# Altium schematic sheet Master_Schematik.SchDoc: Battery Management System
size 381 x 241 mm; DrawnBy: Tristan Horvath; SheetNumber: 1; SheetTotal: 1
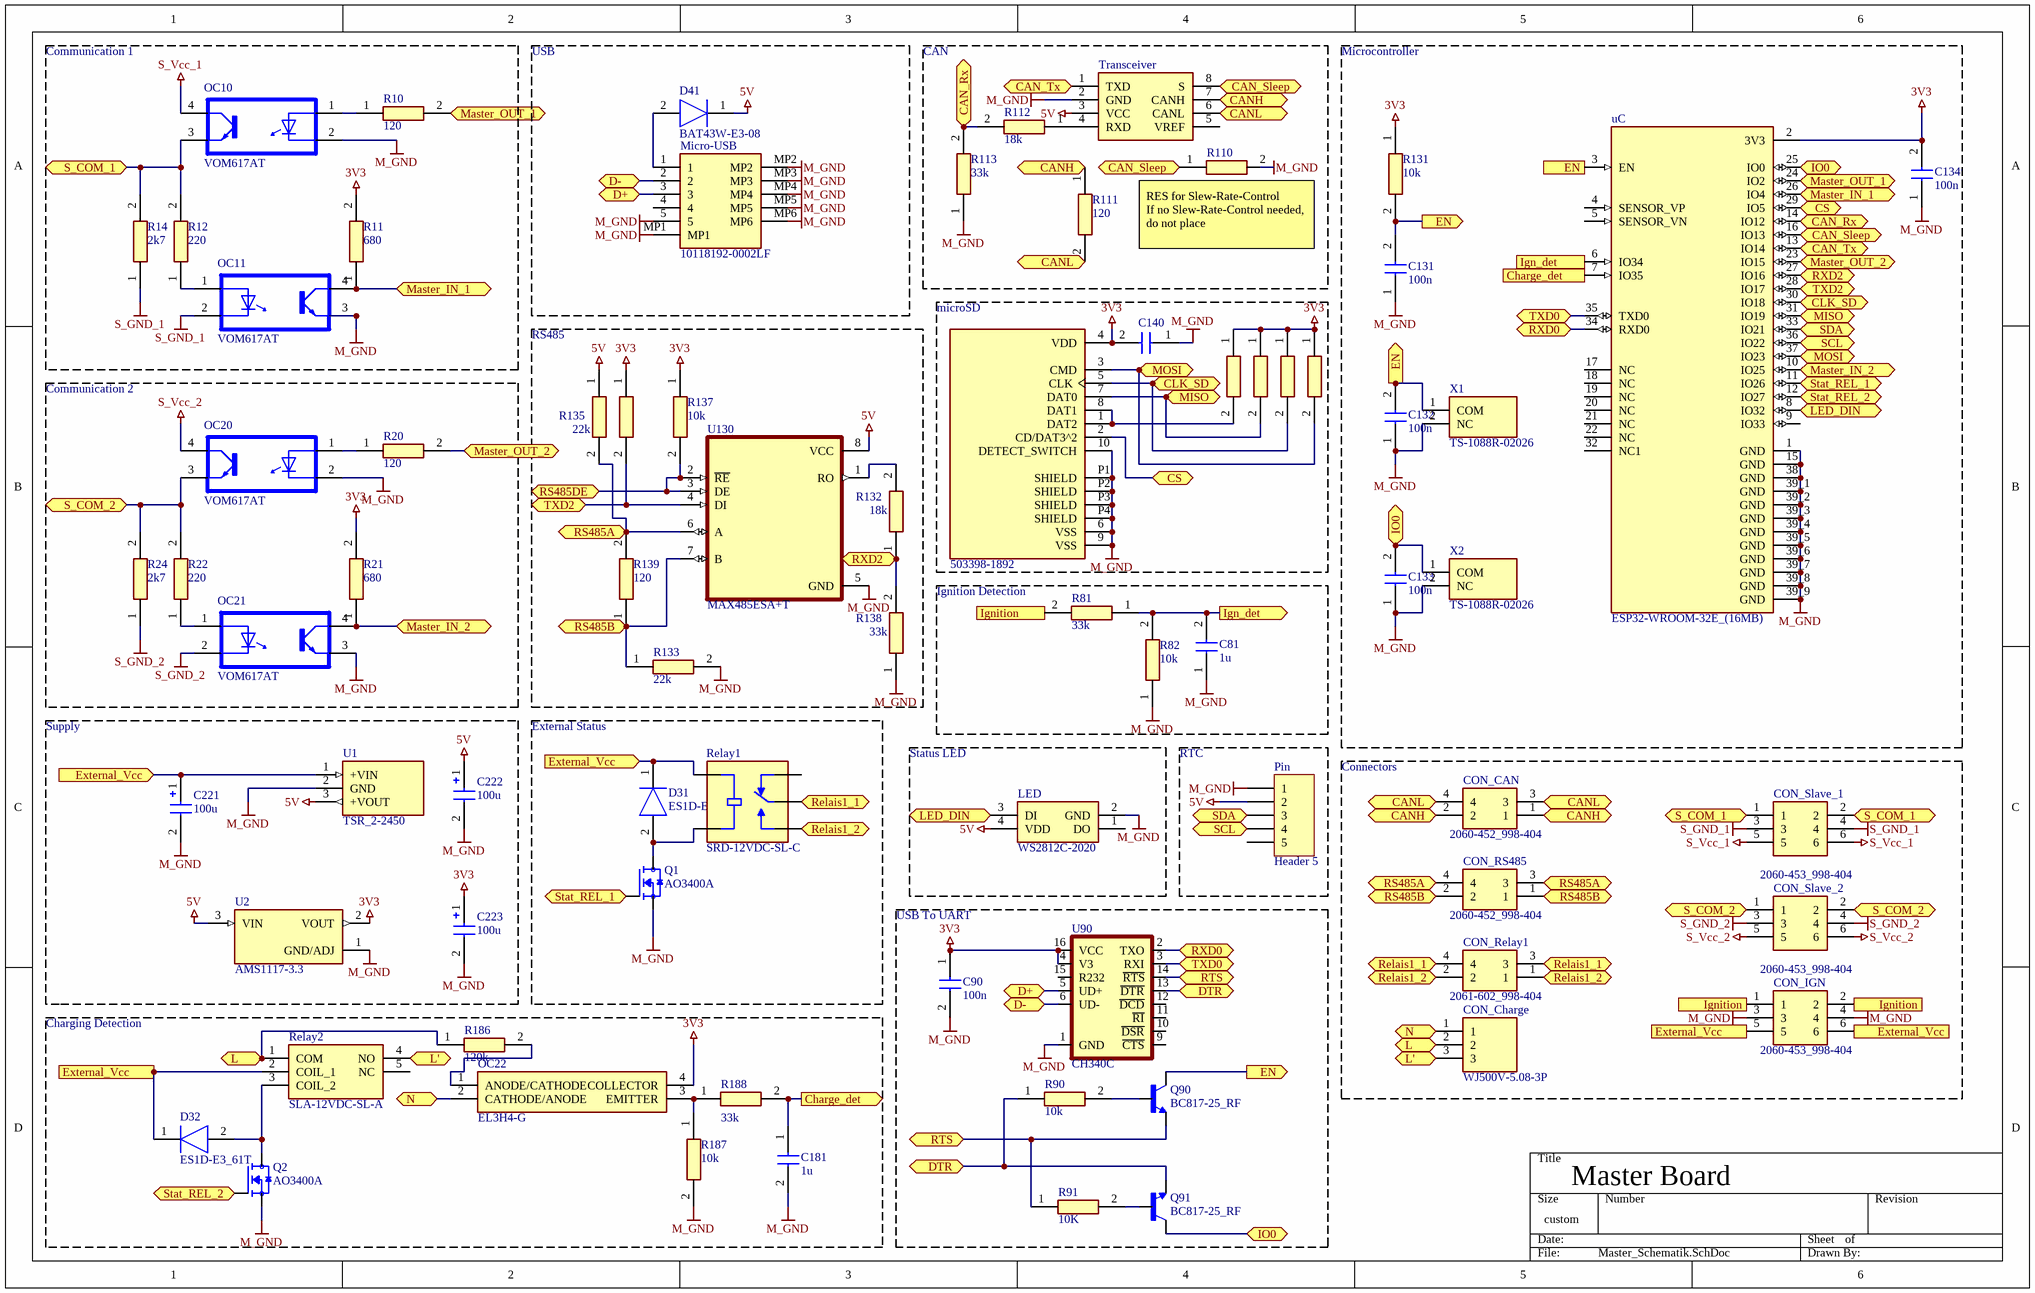
[diagram p0: Master_Schematik.SchDoc]

## Parts
C81  1u  [CAPC1608X90N]
C90  100n  [CAPC1608X90N]
C131  100n  [CAPC1608X90N]
C132  100n  [CAPC1608X90N]
C133  100n  [CAPC1608X90N]
C134  100n  [CAPC1608X90N]
C140  0.1u  [CAPC1608X90N]  (value not drawn)
C181  1u  [CAPC1608X90N]
C221  100u  [CAPAE530X550N]
C222  100u  [CAPAE530X550N]
C223  100u  [CAPAE530X550N]
CON_CAN  2060-452_998-404  [2060-452998-404]
CON_Charge  WJ500V-5.08-3P  [SHDR3W95P0X508_1X3_1524X1000X1420P]
CON_IGN  2060-453_998-404  [2060-453998-404]
CON_Relay1  2061-602_998-404  [2061-602998-404]
CON_RS485  2060-452_998-404  [2060-452998-404]
CON_Slave_1  2060-453_998-404  [2060-453998-404]
CON_Slave_2  2060-453_998-404  [2060-453998-404]
D31  ES1D-E3_61T  [DIOM5127X229N]
D32  ES1D-E3_61T  [DIOM5127X229N]
D41  BAT43W-E3-08  [SOD3716X135N]
LED  WS2812C-2020  [WS2812C2020]
Micro-USB  10118192-0002LF  [101181920002LF]
microSD  503398-1892  [MOLEX_503398-1892]
OC10  VOM617AT  [SOIC254P695X242-4N]
OC11  VOM617AT  [SOIC254P695X242-4N]
OC20  VOM617AT  [SOIC254P695X242-4N]
OC21  VOM617AT  [SOIC254P695X242-4N]
OC22  EL3H4-G  [EL3H4G]
Pin  Header 5  [HDR1X5]
Q1  AO3400A  [SOT95P237X112-3N]
Q2  AO3400A  [SOT95P237X112-3N]
Q90  BC817-25_RF  [SOT95P237X112-3N]
Q91  BC817-25_RF  [SOT95P237X112-3N]
R10  120  [RESC1608X55N]
R11  680  [RESC1608X55N]
R12  220  [RESC1608X55N]
R14  2k7  [RESC1608X55N]
R20  120  [RESC1608X55N]
R21  680  [RESC1608X55N]
R22  220  [RESC1608X55N]
R24  2k7  [RESC1608X55N]
R81  33k  [RESC1608X55N]
R82  10k  [RESC1608X55N]
R90  10k  [RESC1608X55N]
R91  10K  [RESC1608X55N]
R110  N.P.  [RESC1608X55N]  (value not drawn)
R111  120  [RESC1608X55N]
R112  18k  [RESC1608X55N]
R113  33k  [RESC1608X55N]
R131  10k  [RESC1608X55N]
R132  18k  [RESC1608X55N]
R133  22k  [RESC1608X55N]
R135  22k  [RESC1608X55N]
R136  10k  [RESC1608X55N]  (value not drawn)
R137  10k  [RESC1608X55N]
R138  33k  [RESC1608X55N]
R139  120  [RESC1608X55N]
R140  10k  [RESC1608X55N]  (value not drawn)
R141  10k  [RESC1608X55N]  (value not drawn)
R142  10k  [RESC1608X55N]  (value not drawn)
R143  10k  [RESC1608X55N]  (value not drawn)
R186  120k  [2512RES]
R187  10k  [RESC1608X55N]
R188  33k  [RESC1608X55N]
Relay1  SRD-12VDC-SL-C  [RELAY_SRD-12VDC-SL-C]
Relay2  SLA-12VDC-SL-A  [SLA12VDCSLA]
Transceiver  TJA1050T_CM_118  [SOIC127P600X175-8N]  (value not drawn)
U1  TSR_2-2450  [TSR-2]
U2  AMS1117-3.3  [SOT229P700X180-4N]
U90  CH340C  [SO016]
U130  MAX485ESA+T  [SOIC127P600X175-8N]
uC  ESP32-WROOM-32E_(16MB)  [XCVR_ESP32-WROOM-32E_(16MB) - duplicate]
X1  TS-1088R-02026  [TS1088R02026]
X2  TS-1088R-02026  [TS1088R02026]

## Blocks framed on the sheet
Communication 1: OC10 OC11 R10-R12 R14
USB: D41 Micro-USB
CAN: R110-R113 Transceiver
Microcontroller: C131-C134 R131 uC X1 X2
RS485: R132 R133 R135-R139 U130
Communication 2: OC20 OC21 R20-R22 R24
Ignition Detection: C81 R81 R82
Supply: C221-C223 U1 U2
External Status: D31 Q1 Relay1
Status LED: LED
RTC: Pin
Connectors: CON_CAN CON_Charge CON_IGN CON_Relay1 CON_RS485 CON_Slave_1 CON_Slave_2
USB To UART: C90 Q90 Q91 R90 R91 U90
Charging Detection: C181 D32 OC22 Q2 R186-R188 Relay2

## Ports
CAN_Rx (bidir), CAN_Sleep (bidir), CAN_Tx (bidir), CANH (bidir), CANL (bidir), Charge_det (in), Charge_det (out), CLK_SD (bidir), CS (bidir), D+ (bidir), D- (bidir), DTR (bidir), EN (in), EN (out), External_Vcc (in), External_Vcc (out), Ign_det (in), Ign_det (out), Ignition (in), Ignition (out), IO0 (bidir), L (bidir), L' (bidir), LED_DIN (bidir), Master_IN_1 (bidir), Master_IN_2 (bidir), Master_OUT_1 (bidir), Master_OUT_2 (bidir), MISO (bidir), MOSI (bidir), N (bidir), Relais1_1 (bidir), Relais1_2 (bidir), RS485A (bidir), RS485B (bidir), RS485DE (bidir), RTS (bidir), RXD0 (bidir), RXD2 (bidir), S_COM_1 (bidir), S_COM_2 (bidir), SCL (bidir), SDA (bidir), Stat_REL_1 (bidir), Stat_REL_2 (bidir), TXD0 (bidir), TXD2 (bidir)

## Nets
3V3: C90.1 C134.2 C140.2 C223.1(+) microSD.4(VDD) OC22.4(COLLECTOR) R11.2 R21.2 R131.1 R136.1 R137.1 R140.1 R141.1 R142.1 R143.1 U2.2(VOUT) U90.4(V3) U90.16(VCC) uC.2(3V3)
5V: C222.1(+) D41.1(K) LED.4(VDD) Pin.2 R135.1 Transceiver.3(VCC) U1.3(+VOUT) U2.3(VIN) U130.8(VCC)
M_GND: C81.1 C90.2 C131.1 C132.1 C133.1 C134.1 C140.1 C181.2 C221.2(-) C222.2(-) C223.2(-) CON_IGN.3 CON_IGN.4 LED.2(GND) Micro-USB.5 Micro-USB.MP1 Micro-USB.MP2 Micro-USB.MP3 Micro-USB.MP4 Micro-USB.MP5 Micro-USB.MP6 microSD.6(VSS) microSD.9(VSS) microSD.10(DETECT_SWITCH) microSD.P1(SHIELD) microSD.P2(SHIELD) microSD.P3(SHIELD) microSD.P4(SHIELD) OC10.2(C) OC11.3(E) OC20.2(C) OC21.3(E) Pin.1 Q1.2(S) Q2.2(S) R82.1 R110.2 R113.1 R133.2 R138.1 R187.2 Transceiver.2(GND) U1.2(GND) U2.1(GND/ADJ) U90.1(GND) U130.5(GND) uC.1(GND) uC.15(GND) uC.38(GND) uC.39_1(GND) uC.39_2(GND) uC.39_3(GND) uC.39_4(GND) uC.39_5(GND) uC.39_6(GND) uC.39_7(GND) uC.39_8(GND) uC.39_9(GND) X1.2(NC) X2.2(NC)
S_GND_1: CON_Slave_1.3 CON_Slave_1.4 OC11.2(C) R14.1
S_GND_2: CON_Slave_2.3 CON_Slave_2.4 OC21.2(C) R24.1
S_Vcc_1: CON_Slave_1.5 CON_Slave_1.6 OC10.4(CO)
S_Vcc_2: CON_Slave_2.5 CON_Slave_2.6 OC20.4(CO)
CAN_Rx: R112.2 R113.2 uC.14(IO12) ; port CAN_Rx
CAN_Sleep: R110.1 Transceiver.8(S) uC.16(IO13) ; port CAN_Sleep
CAN_Tx: Transceiver.1(TXD) uC.13(IO14) ; port CAN_Tx
CANH: CON_CAN.1 CON_CAN.2 R111.1 Transceiver.7(CANH) ; port CANH
CANL: CON_CAN.3 CON_CAN.4 R111.2 Transceiver.6(CANL) ; port CANL
Charge_det: C181.1 R188.2 uC.7(IO35) ; port Charge_det
CLK_SD: microSD.5(CLK) R142.2 uC.30(IO18) ; port CLK_SD
CS: microSD.2(CD/DAT3^2) uC.29(IO5) ; port CS
D+: Micro-USB.3 U90.5(UD+) ; port D+
D-: Micro-USB.2 U90.6(UD-) ; port D-
DTR: Q91.2(E) R90.1 U90.13(~{DTR}) ; port DTR
EN: C131.2 C132.2 Q90.3(C) R131.2 uC.3(EN) X1.1(COM) ; port EN
External_Vcc: C221.1(+) CON_IGN.5 CON_IGN.6 D31.1(K) D32.1(K) Relay1.COIL1 Relay2.2(COIL_1) U1.1(+VIN) ; port External_Vcc
Ign_det: C81.2 R81.1 R82.2 uC.6(IO34) ; port Ign_det
Ignition: CON_IGN.1 CON_IGN.2 R81.2 ; port Ignition
IO0: C133.2 Q91.3(C) uC.25(IO0) X2.1(COM) ; port IO0
L: CON_Charge.2 R186.1 Relay2.1(COM) ; port L
L': CON_Charge.3 Relay2.4(NO) ; port L'
LED_DIN: LED.3(DI) uC.8(IO32) ; port LED_DIN
Master_IN_1: OC11.4(CO) R11.1 uC.26(IO4) ; port Master_IN_1
Master_IN_2: OC21.4(CO) R21.1 uC.10(IO25) ; port Master_IN_2
Master_OUT_1: R10.2 uC.24(IO2) ; port Master_OUT_1
Master_OUT_2: R20.2 uC.23(IO15) ; port Master_OUT_2
MISO: microSD.7(DAT0) R141.2 uC.31(IO19) ; port MISO
MOSI: microSD.3(CMD) R143.2 uC.37(IO23) ; port MOSI
N: CON_Charge.1 OC22.2(CATHODE/ANODE) ; port N
Relais1_1: CON_Relay1.3 CON_Relay1.4 Relay1.COM ; port Relais1_1
Relais1_2: CON_Relay1.1 CON_Relay1.2 Relay1.NO ; port Relais1_2
RS485A: CON_RS485.3 CON_RS485.4 R135.2 R139.2 U130.6(A) ; port RS485A
RS485B: CON_RS485.1 CON_RS485.2 R133.1 R139.1 U130.7(B) ; port RS485B
RS485DE: R137.2 U130.2(~{RE}) U130.3(DE) ; port RS485DE
RTS: Q90.2(E) R91.1 U90.14(~{RTS}) ; port RTS
RXD0: U90.2(TXO) uC.34(RXD0) ; port RXD0
RXD2: R132.1 R138.2 uC.27(IO16) ; port RXD2
S_COM_1: CON_Slave_1.1 CON_Slave_1.2 OC10.3(E) R12.2 R14.2 ; port S_COM_1
S_COM_2: CON_Slave_2.1 CON_Slave_2.2 OC20.3(E) R22.2 R24.2 ; port S_COM_2
SCL: Pin.4 uC.36(IO22) ; port SCL
SDA: Pin.3 uC.33(IO21) ; port SDA
Stat_REL_1: Q1.1(G) uC.11(IO26) ; port Stat_REL_1
Stat_REL_2: Q2.1(G) uC.12(IO27) ; port Stat_REL_2
TXD0: U90.3(RXI) uC.35(TXD0) ; port TXD0
TXD2: R136.2 U130.4(DI) uC.28(IO17) ; port TXD2
NetD31_2: D31.2(A) Q1.3(D) Relay1.COIL2
NetD32_2: D32.2(A) Q2.3(D) Relay2.3(COIL_2)
NetD41_2: D41.2(A) Micro-USB.1
NetmicroSD_1: microSD.1(DAT2) microSD.8(DAT1) R140.2
NetOC10_1: OC10.1(A) R10.1
NetOC11_1: OC11.1(A) R12.1
NetOC20_1: OC20.1(A) R20.1
NetOC21_1: OC21.1(A) R22.1
NetOC22_1: OC22.1(ANODE/CATHODE) R186.2
NetOC22_3: OC22.3(EMITTER) R187.1 R188.1
NetQ90_1: Q90.1(B) R90.2
NetQ91_1: Q91.1(B) R91.2
NetR112_1: R112.1 Transceiver.4(RXD)
NetR132_2: R132.2 U130.1(RO)

Not connected (* = marked no-connect by the designer): LED 1(DO); Micro-USB 4; Pin 5; Relay1 NC; Relay2 5(NC); Transceiver 5(VREF); U90 9(~{CTS}) 10(~{DSR}) 11(~{RI}) 12(~{DCD}) 15(R232); uC 4(SENSOR_VP) 5(SENSOR_VN) 9(IO33) 17(NC) 18(NC) 19(NC) 20(NC) 21(NC) 22(NC) 32(NC1)

## Notes on the sheet
- (near R110) RES for Slew-Rate-Control
  If no Slew-Rate-Control needed, do not place
- Master Board

## Library data of the parts
C81 C90 C131-C134 C140 = CAP
C181 = CAP: Tp mit fg 5Hz
C221-C223 = ELKO
CON_CAN CON_RS485 = 2060-452_998-404: Connector; Manufacturer_Name: Wago; Manufacturer_Part_Number: 2061-602/998-404; Arrow Part Number: 2060-452/998-404; Arrow Price/Stock: https://www.arrow.com/en/products/2060-452998-404/wago-kontakttechnik-gmbh?region=nac
CON_Charge = WJ500V-5.08-3P: P=5.08mm Screw terminal RoHS; Manufacturer_Name: Ningbo Kangnex; Geometry.Height: 14.2mm; Manufacturer_Part_Number: WJ500V-5.08-3P; Mouser Part Number: *; Mouser Price/Stock: *; Arrow Part Number: *; Arrow Price/Stock: *; Datasheet Link: https://datasheet.lcsc.com/szlcsc/Ningbo-Kangnex-Elec-WJ500V-5-08-3P-14-00A_C72334.pdf
CON_IGN CON_Slave_1 CON_Slave_2 = 2060-453_998-404: Connector; Manufacturer_Name: Wago; Manufacturer_Part_Number: 2060-452/998-404; Arrow Part Number: 2060-452/998-404; Arrow Price/Stock: https://www.arrow.com/en/products/2060-452998-404/wago-kontakttechnik-gmbh?region=nac
CON_Relay1 = 2061-602_998-404: Connector; Manufacturer_Name: Wago; Manufacturer_Part_Number: 2060-452/998-404; Arrow Part Number: 2060-452/998-404; Arrow Price/Stock: https://www.arrow.com/en/products/2060-452998-404/wago-kontakttechnik-gmbh?region=nac
D31 D32 = ES1D-E3_61T: Diode; Manufacturer_Name: Vishay; Manufacturer_Part_Number: ES1D-E3/61T; Datasheet Link: https://componentsearchengine.com/Datasheets/2/ES1D-E3_61T.pdf; Height: 2.29mm; Mouser Part Number: 625-ES1D-E3; Mouser Price/Stock: https://www.mouser.co.uk/ProductDetail/Vishay-General-Semiconductor/ES1D-E3-61T?qs=rfh7uIuiIO0XwaKoN5aNdQ%3D%3D; Arrow Part Number: ES1D-E3/61T; Arrow Price/Stock: https://www.arrow.com/en/products/es1d-e361t/vishay
D41 = BAT43W-E3-08: Diode; Manufacturer_Name: Vishay; Datasheet Link: https://www.arrow.com/en/products/bat43w-e3-08/vishay; Height: 1.35mm; Manufacturer_Part_Number: BAT43W-E3-08; Mouser Part Number: 78-BAT43W-E3-08; Mouser Price/Stock: https://www.mouser.co.uk/ProductDetail/Vishay-Semiconductors/BAT43W-E3-08?qs=KP8Io%2FXyE5RCw3lmmA3XwQ%3D%3D; Arrow Part Number: BAT43W-E3-08; Arrow Price/Stock: https://www.arrow.com/en/products/bat43w-e3-08/vishay?region=nac
LED = WS2812C-2020: LED; Manufacturer_Name: Worldsemi; Datasheet Link: http://www.world-semi.com/DownLoadFile/139; Height: 0.84mm; Manufacturer_Part_Number: WS2812C-2020
Micro-USB = 10118192-0002LF: Connector; Manufacturer_Name: Amphenol; Datasheet Link: https://componentsearchengine.com/Datasheets/1/10118192-0002LF.pdf; Height: 3.05mm; Manufacturer_Part_Number: 10118192-0002LF; Mouser Part Number: 649-10118192-0002LF; Mouser Price/Stock: https://www.mouser.co.uk/ProductDetail/Amphenol-FCI/10118192-0002LF?qs=KVgMXE4aH4nIkuWlMxQzog%3D%3D; Arrow Part Number: 10118192-0002LF; Arrow Price/Stock: https://www.arrow.com/en/products/10118192-0002lf/amphenol-fci?region=nac
microSD = 503398-1892: 9 (8 + 1) Position Card Connector Secure Digital - microSDâ„¢ Surface Mount, Right Angle Gold; MP: 5033981892; MF: Molex; Check_prices: https://www.snapeda.com/parts/5033981892/Molex/view-part/?ref=eda; Value: *; Availability: In Stock; Price: None; Package: None; SnapEDA_Link: https://www.snapeda.com/parts/5033981892/Molex/view-part/?ref=snap; Purchase-URL: https://pricing.snapeda.com/search/part/5033981892/?ref=eda
OC10 OC11 OC20 OC21 = VOM617AT: Optoisolator Transistor Output 3750Vrms 1 Channel 4-SOP _2.54mm_; MF: Vishay Semiconductor; Package: SOP-4 Vishay Semiconductor; Value: *; Availability: Unavailable; SnapEDA_Link: https://www.snapeda.com/parts/VOM617AT/Vishay%20Semiconductor%20Opto%20Division/view-part/289684/?ref=snap; Price: None; MP: VOM617AT
OC22 = EL3H4-G: OPTOISOLATOR 3.75KV TRANS 4-SSOP; Manufacturer_Name: Everlight; Geometry.Height: 2mm; Manufacturer_Part_Number: EL3H4-G; Mouser Part Number: 638-EL3H4G; Mouser Price/Stock: https://www.mouser.co.uk/ProductDetail/Everlight/EL3H4-G?qs=8PzhAHr7IdNyIMBpWTp8ig%3D%3D; Arrow Part Number: *; Arrow Price/Stock: *; Datasheet Link: https://componentsearchengine.com/Datasheets/1/EL3H4-G.pdf
Pin = Header 5: Header, 5-Pin; LatestRevisionDate: 17-Jul-2002; LatestRevisionNote: Re-released for DXP Platform.; Publisher: Altium Limited
Q1 Q2 = AO3400A: Trans MOSFET N-CH 30V 5.7A 3-Pin SOT-23; Package: None; Price: None; Availability: Unavailable; MP: AO3400A; Value: *
Q90 Q91 = BC817-25_RF: SOT-23, 50V, 0.5A, NPN Bipolar Transistor; MF: Taiwan Semiconductor; MP: BC817-25 RF; Package: SOT-23 Taiwan Semiconductor; Value: *; Availability: In Stock; Check_prices: https://www.snapeda.com/parts/BC817-25%20RF/Taiwan+Semiconductor/view-part/?ref=eda; SnapEDA_Link: https://www.snapeda.com/parts/BC817-25%20RF/Taiwan+Semiconductor/view-part/?ref=snap; Price: None; Purchase-URL: https://pricing.snapeda.com/search/part/BC817-25 RF/?ref=eda
R10-R12 R14 R20-R22 R24 R81 R82 R90 R91 R110-R113 R131-R133 R135-R143 R186 R187 = RES
R188 = RES: TP mit fg 5Hz
Relay1 = SRD-12VDC-SL-C: General Purpose Non Latching 12VDC SPDT Through Hole Relays RoHS; Price: None; Package: None; Availability: Unavailable; MP: SRD-12VDC-SL-C; Value: *
Relay2 = SLA-12VDC-SL-A: Relay or Contactor; Manufacturer_Name: Songle Relay; Datasheet Link: https://datasheet.lcsc.com/szlcsc/1811200235_Ningbo-Songle-Relay-SLA-12VDC-SL-A_C55194.pdf; Height: 20.4mm; Manufacturer_Part_Number: SLA-12VDC-SL-A
Transceiver = TJA1050T_CM_118: NXP - TJA1050T/CM,118 - CAN TRANSCEIVER, 1TX/RX, SOIC-8; Geometry.Height: 1.75mm; Manufacturer_Name: NXP; Manufacturer_Part_Number: TJA1050T/CM,118; Mouser Part Number: 771-TJA1050T/CM118; Mouser Price/Stock: https://www.mouser.co.uk/ProductDetail/NXP-Semiconductors/TJA1050T-CM118?qs=5XOdhvmYM0NFFspw0VP5sA%3D%3D; Arrow Part Number: TJA1050T/CM,118; Arrow Price/Stock: https://www.arrow.com/en/products/tja1050tcm118/nxp-semiconductors?region=nac; Datasheet Link: http://www.nxp.com/docs/en/data-sheet/TJA1050.pdf
U1 = TSR_2-2450: Power Supply; Manufacturer_Name: Traco Power; Manufacturer_Part_Number: TSR 2-2450; Datasheet Link: https://tracopower.com/tsr2-datasheet/; Mouser Part Number: 495-TSR2-2450; Mouser Price/Stock: https://www.mouser.co.uk/ProductDetail/TRACO-Power/TSR-2-2450?qs=NtE2QagKf6RzknAolzm%2FTQ%3D%3D; Arrow Part Number: TSR 2-2450; Arrow Price/Stock: https://www.arrow.com/en/products/tsr2-2450/traco-electronic-ag?region=europe
U2 = AMS1117-3.3: Sot223/Pkg 1-Amp 3.3-Volt Low Drop Out Voltage Regulatator; MF: Advanced Monolithic Systems; Package: SOT-223 Seeed Technology; Value: *; Check_prices: https://www.snapeda.com/parts/AMS1117-3.3/Advanced+Monolithic+Systems/view-part/?ref=eda; Price: None; Availability: Not in stock; MP: AMS1117-3.3; SnapEDA_Link: https://www.snapeda.com/parts/AMS1117-3.3/Advanced+Monolithic+Systems/view-part/?ref=snap
U90 = CH340C: Replacement for Brother P-Touch; MF: Olimex; SnapEDA_Link: https://www.snapeda.com/parts/CH340C/Olimex/view-part/?ref=snap; Availability: Not in stock; MP: CH340C; Price: None; Value: *; Check_prices: https://www.snapeda.com/parts/CH340C/Olimex/view-part/?ref=eda; Package: None
U130 = MAX485ESA+T: 1/1 Transceiver Half RS422, RS485 8-SOIC; MF: Maxim Integrated; MP: MAX485ESA; SnapEDA_Link: https://www.snapeda.com/parts/MAX485ESA/Maxim+Integrated/view-part/?ref=snap; Purchase-URL: https://pricing.snapeda.com/search/part/MAX485ESA/?ref=eda; Value: *; Package: SOIC-8 Maxim; Price: None; Availability: In Stock; Check_prices: https://www.snapeda.com/parts/MAX485ESA/Maxim+Integrated/view-part/?ref=eda
uC = ESP32-WROOM-32E_(16MB): Bluetooth, WiFi 802.11b/g/n, Bluetooth v4.2 +EDR, Class 1, 2 and 3 Transceiver Module 2.4GHz ~ 2.5GHz Integrated, Trace Surface Mount; MP: ESP32-WROOM-32E (16MB); MF: Espressif Systems; Price: None; Availability: Not in stock; Package: None; Value: *; SnapEDA_Link: https://www.snapeda.com/parts/ESP32-WROOM-32E%20(16MB)/Espressif+Systems/view-part/?ref=snap; Check_prices: https://www.snapeda.com/parts/ESP32-WROOM-32E%20(16MB)/Espressif+Systems/view-part/?ref=eda
X1 X2 = TS-1088R-02026: SMD,3x4x2.0mm Tactile Switches; Manufacturer_Name: XUNPU; Geometry.Height: 2.2mm; Manufacturer_Part_Number: TS-1088R-02026; Mouser Part Number: *; Mouser Price/Stock: *; Arrow Part Number: *; Arrow Price/Stock: *; Datasheet Link: https://datasheet.lcsc.com/szlcsc/1912111437_XUNPU-TS-1088R-02026_C455280.pdf